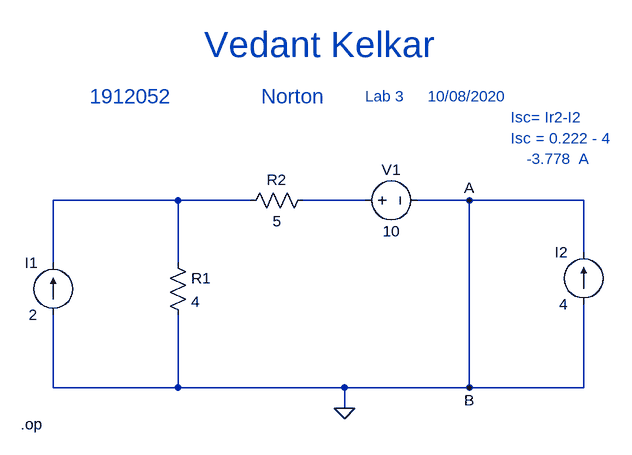
[diagram p0: schematic Draft7.asc]
Draft7.asc, the LTspice schematic file:
Version 4
SHEET 1 880 680
WIRE -80 48 -272 48
WIRE 32 48 -80 48
WIRE 208 48 112 48
WIRE 368 48 288 48
WIRE 544 48 368 48
WIRE 544 128 544 48
WIRE -272 144 -272 48
WIRE -80 144 -80 48
WIRE -272 336 -272 224
WIRE -80 336 -80 224
WIRE -80 336 -272 336
WIRE 176 336 -80 336
WIRE 368 336 368 48
WIRE 368 336 176 336
WIRE 544 336 544 208
WIRE 544 336 368 336
WIRE 176 368 176 336
FLAG 176 368 0
FLAG 368 48 A
FLAG 368 336 B
SYMBOL current -272 224 R180
WINDOW 0 24 80 Left 2
WINDOW 3 24 0 Left 2
WINDOW 123 0 0 Left 0
WINDOW 39 0 0 Left 0
SYMATTR InstName I1
SYMATTR Value 2
SYMBOL res -96 128 R0
SYMATTR InstName R1
SYMATTR Value 4
SYMBOL res 128 32 R90
WINDOW 0 0 56 VBottom 2
WINDOW 3 32 56 VTop 2
SYMATTR InstName R2
SYMATTR Value 5
SYMBOL voltage 192 48 R270
WINDOW 0 32 56 VTop 2
WINDOW 3 -32 56 VBottom 2
WINDOW 123 0 0 Left 0
WINDOW 39 0 0 Left 0
SYMATTR InstName V1
SYMATTR Value 10
SYMBOL current 544 208 R180
WINDOW 0 24 80 Left 2
WINDOW 3 24 0 Left 2
WINDOW 123 0 0 Left 0
WINDOW 39 0 0 Left 0
SYMATTR InstName I2
SYMATTR Value 4
TEXT -40 -192 Left 5 ;Vedant Kelkar
TEXT -216 -112 Left 3 ;1912052
TEXT 48 -112 Left 3 ;Norton
TEXT 208 -112 Left 2 ;Lab 3
TEXT 304 -112 Left 2 ;10/08/2020
TEXT -322 392 Left 2 !.op
TEXT 432 -80 Left 2 ;Isc= Ir2-I2
TEXT 432 -48 Left 2 ;Isc = 0.222 - 4
TEXT 456 -16 Left 2 ;-3.778
TEXT 536 -16 Left 2 ;A

The netlist it stands for:
* Draft7.asc
I1 0 N001 2
R1 N001 0 4
R2 N002 N001 5
V1 N002 0 10
I2 0 0 4
* Vedant Kelkar
* 1912052
* Norton
* Lab 3
* 10/08/2020
.op
* Isc= Ir2-I2
* Isc = 0.222 - 4
* -3.778
* A
.backanno
.end